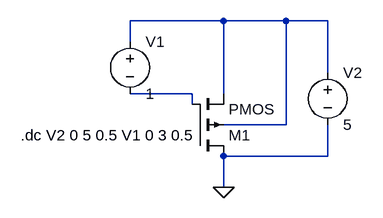
[diagram p0: schematic pmos4_circuit_diagram.asc]
pmos4_circuit_diagram.asc, the LTspice schematic file:
Version 4
SHEET 1 880 680
WIRE 128 64 -16 64
WIRE 224 64 128 64
WIRE 288 64 224 64
WIRE -16 96 -16 64
WIRE 288 144 288 64
WIRE 80 176 -16 176
WIRE 128 176 128 64
WIRE 80 192 80 176
WIRE 224 224 224 64
WIRE 224 224 128 224
WIRE 128 272 128 256
WIRE 288 272 288 224
WIRE 288 272 128 272
WIRE 128 320 128 272
FLAG 128 320 0
SYMBOL pmos4 80 272 M180
SYMATTR InstName M1
SYMBOL voltage -16 80 R0
WINDOW 123 0 0 Left 0
WINDOW 39 0 0 Left 0
SYMATTR InstName V1
SYMATTR Value 1
SYMBOL voltage 288 128 R0
WINDOW 123 0 0 Left 0
WINDOW 39 0 0 Left 0
SYMATTR InstName V2
SYMATTR Value 5
TEXT -184 240 Left 0 !.dc V2 0 5 0.5 V1 0 3 0.5

The netlist it stands for:
* pmos4_circuit_diagram.asc
M1 0 N002 N001 N001 PMOS
V1 N001 N002 1
V2 N001 0 5
.model NMOS NMOS
.model PMOS PMOS
.lib standard.mos
.dc V2 0 5 0.5 V1 0 3 0.5
.backanno
.end